# Altium schematic sheet ADC108S022_PINOUT.SchDoc
size A; SheetNumber: 7; SheetTotal: 17
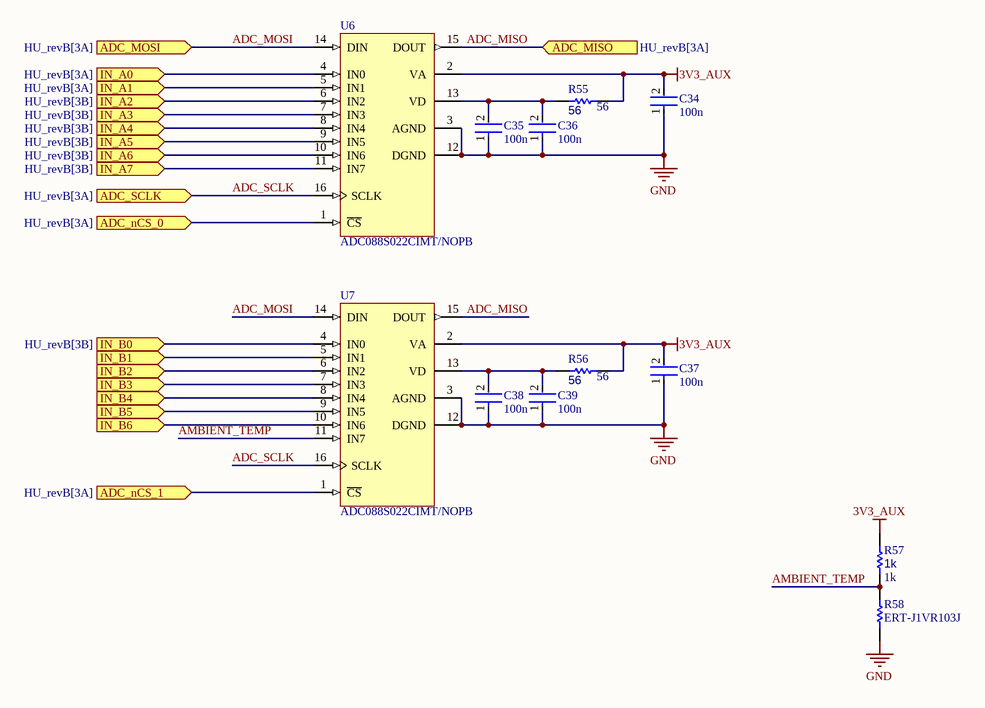
[diagram p0: ADC108S022_PINOUT.SchDoc]

## Parts
C34  100n  [FP-0402-L_1_0_0_05-W_0_5-IPC_A]
C35  100n  [FP-0402-L_1_0_0_05-W_0_5-IPC_A]
C36  100n  [FP-0402-L_1_0_0_05-W_0_5-IPC_A]
C37  100n  [FP-0402-L_1_0_0_05-W_0_5-IPC_A]
C38  100n  [FP-0402-L_1_0_0_05-W_0_5-IPC_A]
C39  100n  [FP-0402-L_1_0_0_05-W_0_5-IPC_A]
R55  56  [R0603B]
R56  56  [R0603B]
R57  1k  [R0603B]
R58  ERT-J1VR103J  [RESC1608X90X30ML15T20]
U6  ADC088S022CIMT/NOPB  [MTC16_L]
U7  ADC088S022CIMT/NOPB  [MTC16_L]

## Ports
ADC_MISO (in, see HU_revB[3A]), ADC_MOSI (in, see HU_revB[3A]), ADC_nCS_0 (in, see HU_revB[3A]), ADC_nCS_1 (in, see HU_revB[3A]), ADC_SCLK (in, see HU_revB[3A]), IN_A0 (in, see HU_revB[3A]), IN_A1 (in, see HU_revB[3A]), IN_A2 (in, see HU_revB[3B]), IN_A3 (in, see HU_revB[3B]), IN_A4 (in, see HU_revB[3B]), IN_A5 (in, see HU_revB[3B]), IN_A6 (in, see HU_revB[3B]), IN_A7 (in, see HU_revB[3B]), IN_B0 (in, see HU_revB[3B]), IN_B1 (in), IN_B2 (in), IN_B3 (in), IN_B4 (in), IN_B5 (in), IN_B6 (in)

## Nets
3V3_AUX: C34.2 C37.2 R55.1 R56.1 R57.1 U6.2(VA) U7.2(VA)
GND: C34.1 C35.1 C36.1 C37.1 C38.1 C39.1 R58.1 U6.3(AGND) U6.12(DGND) U7.3(AGND) U7.12(DGND)
ADC_MISO: U6.15(DOUT) U7.15(DOUT) ; port ADC_MISO
ADC_MOSI: U6.14(DIN) U7.14(DIN) ; port ADC_MOSI
ADC_nCS_0: U6.1(~{CS}) ; port ADC_nCS_0
ADC_nCS_1: U7.1(~{CS}) ; port ADC_nCS_1
ADC_SCLK: U6.16(SCLK) U7.16(SCLK) ; port ADC_SCLK
AMBIENT_TEMP: R57.2 R58.2 U7.11(IN7)
IN_A0: U6.4(IN0) ; port IN_A0
IN_A1: U6.5(IN1) ; port IN_A1
IN_A2: U6.6(IN2) ; port IN_A2
IN_A3: U6.7(IN3) ; port IN_A3
IN_A4: U6.8(IN4) ; port IN_A4
IN_A5: U6.9(IN5) ; port IN_A5
IN_A6: U6.10(IN6) ; port IN_A6
IN_A7: U6.11(IN7) ; port IN_A7
IN_B0: U7.4(IN0) ; port IN_B0
IN_B1: U7.5(IN1) ; port IN_B1
IN_B2: U7.6(IN2) ; port IN_B2
IN_B3: U7.7(IN3) ; port IN_B3
IN_B4: U7.8(IN4) ; port IN_B4
IN_B5: U7.9(IN5) ; port IN_B5
IN_B6: U7.10(IN6) ; port IN_B6
NetC35_2: C35.2 C36.2 R55.2 U6.13(VD)
NetC38_2: C38.2 C39.2 R56.2 U7.13(VD)

## Library data of the parts
C34-C39 = CMP-001-00058-1: LARGE PADS, 0402 CAP, CHANGE COMMENT TO MATCH REAL P/N; Capacitor Type: Ceramic; Min Operating Temperature: -55°C; Mounting Technology: Surface Mount; Pins: 2; Case/Package: 0402; RoHS Compliant: Yes; Max Operating Temperature: 85°C
R55-R57 = CMP-009-00002-14: Resistor
  R55 R56: Value: 56
  R57: Value: 1k
R58 = CMP-2000-00869-1: Manufacturer: Panasonic; Part Number: ERT-J1VR103J
U6 U7 = CMP-0054-00372-2: 8-Channel, 50 kSPS to 200 kSPS, 8-Bit A/D Converter, 16-pin TSSOP, Pb-Free; Manufacturer: National Semiconductor; PackageTopMarking: NSUZXYTT*88S022*CIMT; CompType: ADC IC; PowerWise: Y; ComponentLink2URL: http://www.national.com/pf/AD/ADC088S022.html; RoHS: Y; PackageDescription: Molded TSSOP, Jedec, 5 x 4.4 x 0.9mm Body, 16 Lead, 0.65mm Pitch; DatasheetVersion: Feb-2010; PinCount: 16; ComponentLink1Description: ADC088S022 Datasheet; Code_JEDEC: MO-153-AB; ComponentLink3URL: http://www.national.com/packaging/folders/mtc16.html; PackageVersion: revD, Jun-2003; ComponentLink3Description: MTC16 Package Page; RevisionNote: Component URLs added; ComponentLink1URL: http://www.national.com/ds/AD/ADC088S022.pdf; ComponentLink2Description: ADC088S022 Web Page; PackageReference: MTC16